# Altium project PROC114E3_SCH.PrjPcb (part 21 of 22)

## Sheet 42.SchDoc
size 513 x 386 mm
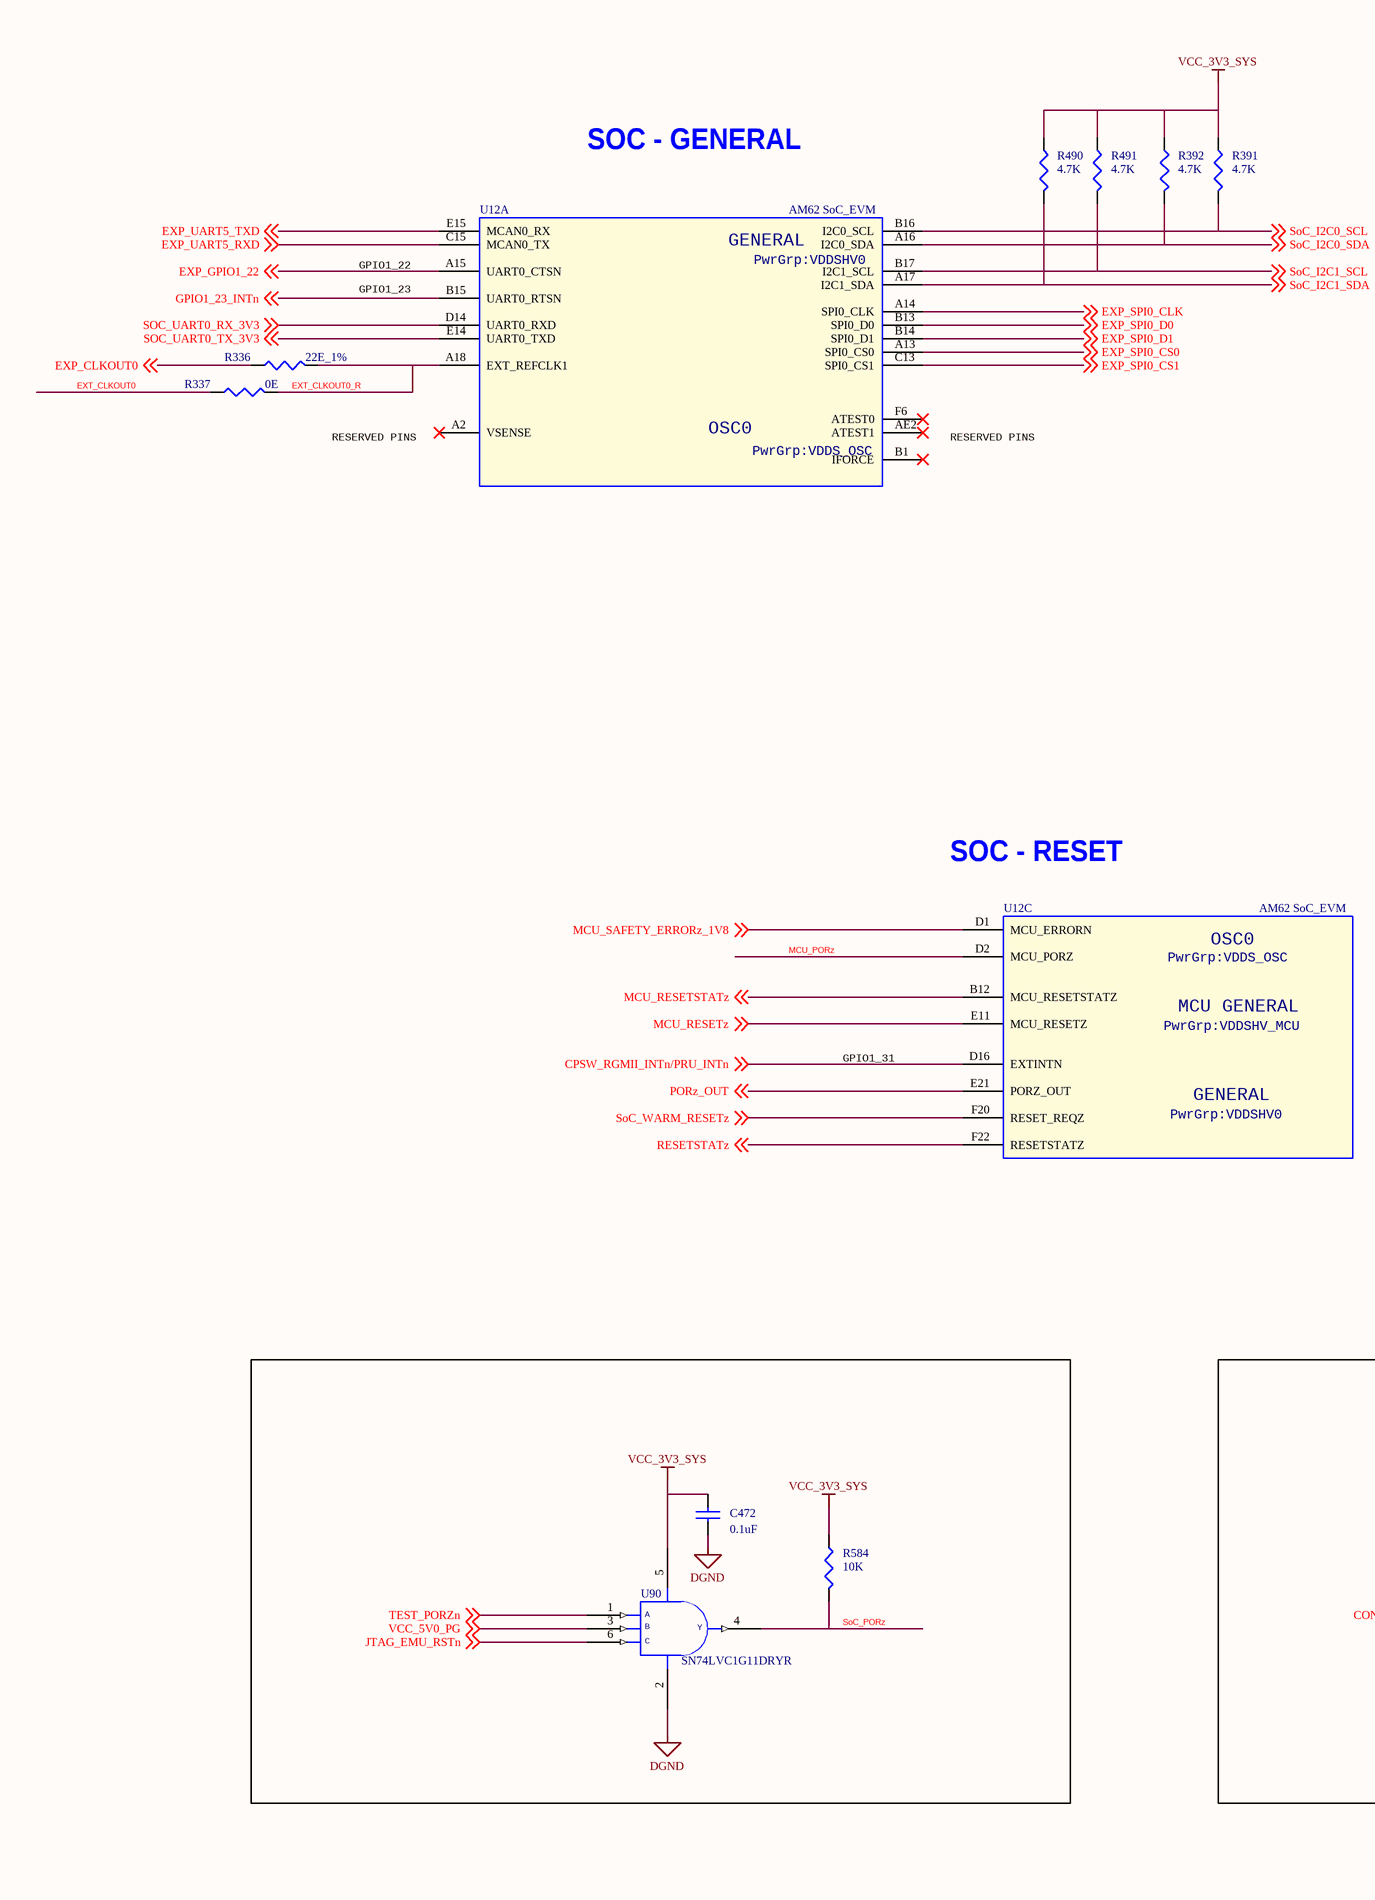
[diagram p75: 42.SchDoc, left]
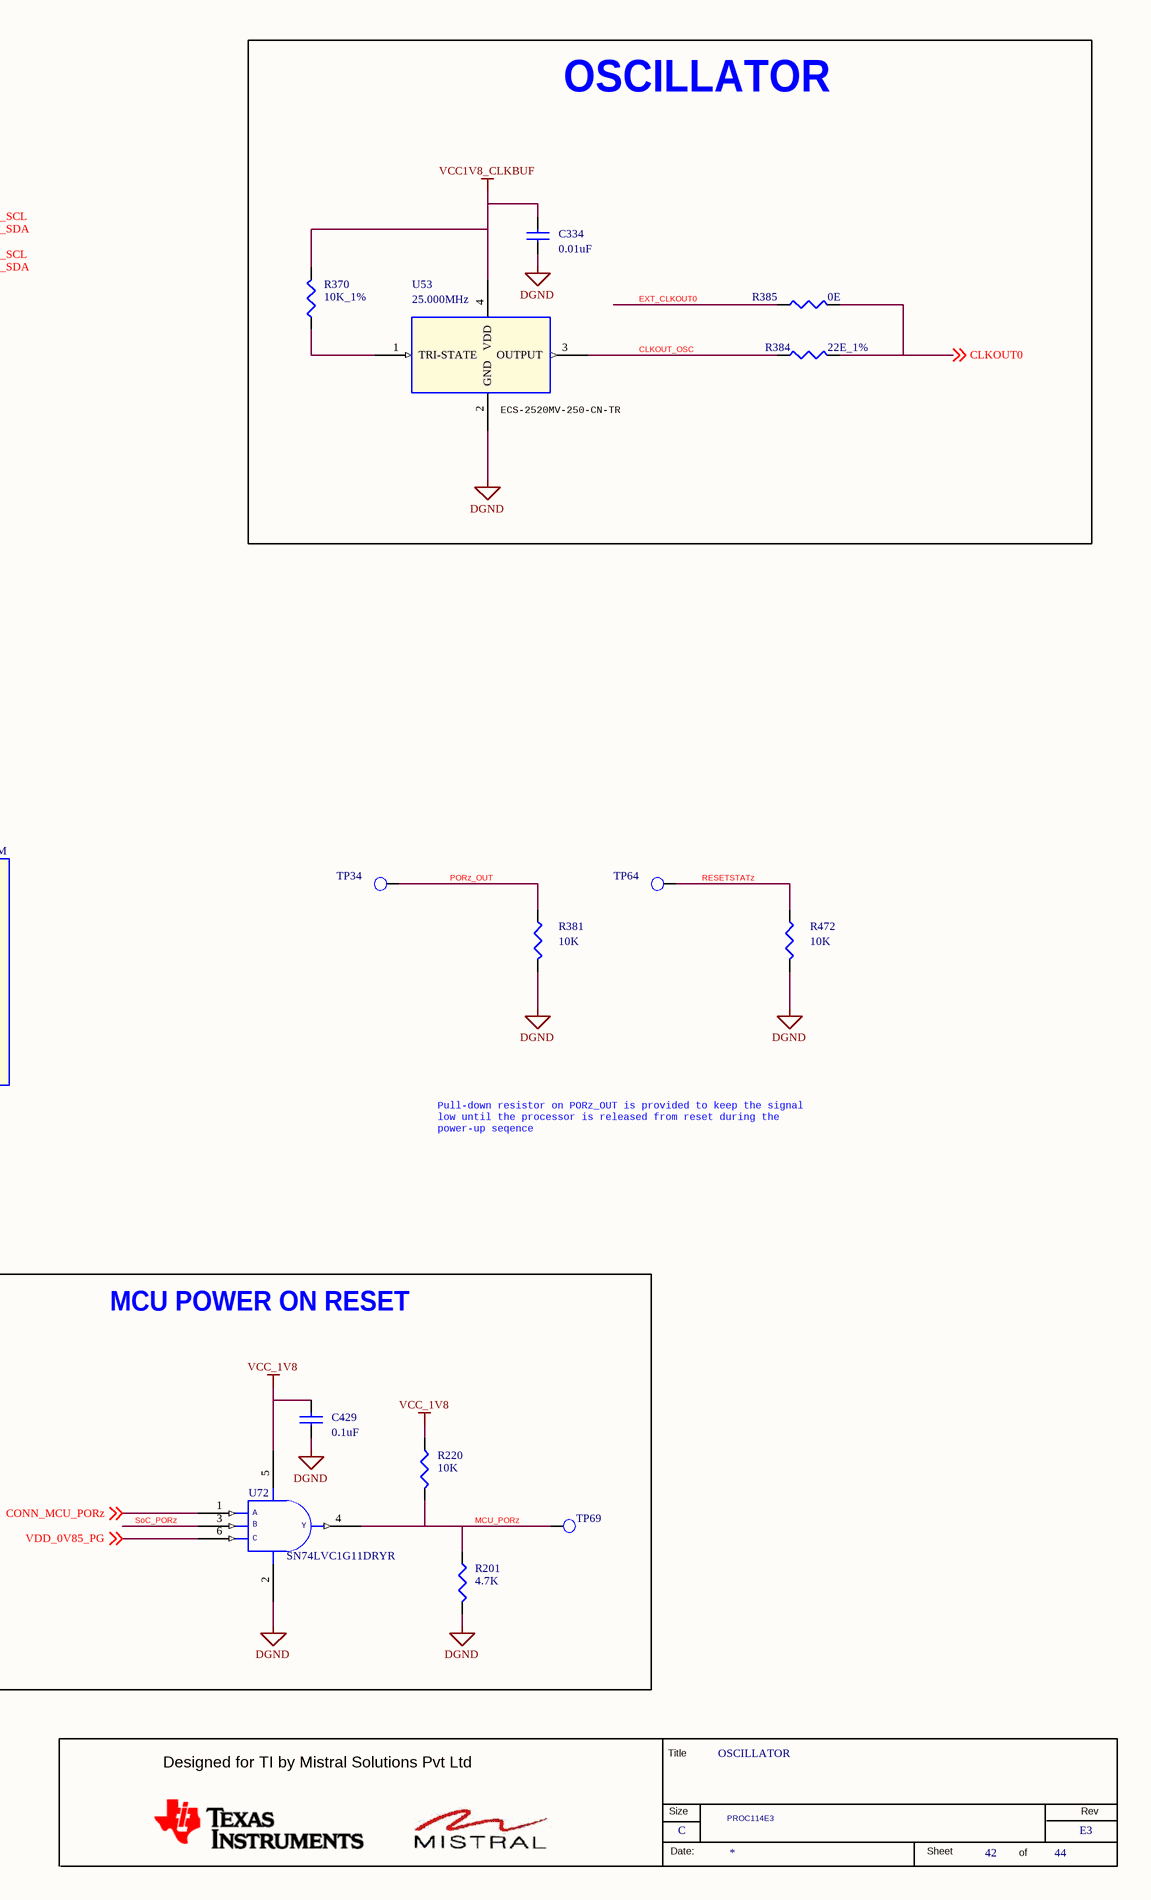
[diagram p76: 42.SchDoc, right]

### Parts
(Parts that share a designator on the sheet are numbered #1, #2 ... from top to bottom, then left to right.)
*#42  RevCode: E3  Title: OSCILLATOR  Page Size: C  Page Number: 42  Page Count: 44  Variant Name: PROC114E3  (hidden comment: MISTRAL_TITLEBLK_CSIZE)  (graphical)
C334  0.01uF  [CAP0201_0-5]
C429  0.1uF  [CAP0201_0-5]
C472  0.1uF  [CAP0201_0-5]
R201  4.7K  [RES0201_0-5]
R220  10K  [RES0201_0-5]
R336  22E_1%  [RES0201_0-5]
R337  0E  [RES0201_0-5]
R370  10K_1%  [RES0201_0-5]
R381  10K  [RES0201_0-5]
R384  22E_1%  [RES0201_0-5]
R385  0E  [RES0201_0-5]
R391  4.7K  [RES0201_0-5]
R392  4.7K  [RES0201_0-5]
R472  10K  [RES0201_0-5]
R490  4.7K  [RES0201_0-5]
R491  4.7K  [RES0201_0-5]
R584  10K  [RES0201_0-5]
TP34  TP20_SMD  [TP20_SMD]  (value not drawn)
TP64  TP20_SMD  [TP20_SMD]  (value not drawn)
TP69  TP20_SMD  [TP20_SMD]  (value not drawn)
U12#2  AM62 SoC_EVM  [BGA425_19-68_510X510_0-7]  (parts A,C of 18)
U53  25.000MHz  [OSC4_ECS-2520MV_100X80_SMD_0-9]
U72  SN74LVC1G11DRYR  [SON6_SN74LVC2G17_40X60_0-6]
U90  SN74LVC1G11DRYR  [SON6_SN74LVC2G17_40X60_0-6]

### Blocks framed on the sheet
OSCILLATOR: C334 R370 R384 R385 U53
MCU POWER ON RESET: C429 R201 R220 TP69 U72

### Nets
DGND: C334.1 C429.1 C472.1 R201.2 R381.2 R472.2 U53.2(GND) U72.2(GND) U90.2(GND)
VCC1V8_CLKBUF: C334.2 R370.2 U53.4(VDD)
VCC_1V8: C429.2 R220.1 U72.5(VCC)
VCC_3V3_SYS: C472.2 R391.1 R392.1 R490.1 R491.1 R584.1 U90.5(VCC)
CLKOUT0: R384.2 R385.2 ; off-sheet CLKOUT0
CLKOUT_OSC: R384.1 U53.3(OUTPUT)
CONN_MCU_PORz: U72.1(A) ; off-sheet CONN_MCU_PORz
CPSW_RGMII_INTn/PRU_INTn: U12#2.D16(EXTINTN) ; off-sheet CPSW_RGMII_INTn/PRU_INTn
EXP_CLKOUT0: R336.1 ; off-sheet EXP_CLKOUT0
EXP_GPIO1_22: U12#2.A15(UART0_CTSN) ; off-sheet EXP_GPIO1_22
EXP_SPI0_CLK: U12#2.A14(SPI0_CLK) ; off-sheet EXP_SPI0_CLK
EXP_SPI0_CS0: U12#2.A13(SPI0_CS0) ; off-sheet EXP_SPI0_CS0
EXP_SPI0_CS1: U12#2.C13(SPI0_CS1) ; off-sheet EXP_SPI0_CS1
EXP_SPI0_D0: U12#2.B13(SPI0_D0) ; off-sheet EXP_SPI0_D0
EXP_SPI0_D1: U12#2.B14(SPI0_D1) ; off-sheet EXP_SPI0_D1
EXP_UART5_RXD: U12#2.C15(MCAN0_TX) ; off-sheet EXP_UART5_RXD
EXP_UART5_TXD: U12#2.E15(MCAN0_RX) ; off-sheet EXP_UART5_TXD
EXT_CLKOUT0: R337.1 R385.1
EXT_CLKOUT0_R: R336.2 R337.2 U12#2.A18(EXT_REFCLK1)
GPIO1_23_INTn: U12#2.B15(UART0_RTSN) ; off-sheet GPIO1_23_INTn
JTAG_EMU_RSTn: U90.6(C) ; off-sheet JTAG_EMU_RSTn
MCU_PORz: R201.1 R220.2 TP69.1(TP) U12#2.D2(MCU_PORZ) U72.4(Y)
MCU_RESETSTATz: U12#2.B12(MCU_RESETSTATZ) ; off-sheet MCU_RESETSTATz
MCU_RESETz: U12#2.E11(MCU_RESETZ) ; off-sheet MCU_RESETz
MCU_SAFETY_ERRORz_1V8: U12#2.D1(MCU_ERRORN) ; off-sheet MCU_SAFETY_ERRORz_1V8
PORz_OUT: R381.1 TP34.1(TP) U12#2.E21(PORZ_OUT) ; off-sheet PORz_OUT
RESETSTATz: R472.1 TP64.1(TP) U12#2.F22(RESETSTATZ) ; off-sheet RESETSTATz
SoC_I2C0_SCL: R391.2 U12#2.B16(I2C0_SCL) ; off-sheet SoC_I2C0_SCL
SoC_I2C0_SDA: R392.2 U12#2.A16(I2C0_SDA) ; off-sheet SoC_I2C0_SDA
SoC_I2C1_SCL: R491.2 U12#2.B17(I2C1_SCL) ; off-sheet SoC_I2C1_SCL
SoC_I2C1_SDA: R490.2 U12#2.A17(I2C1_SDA) ; off-sheet SoC_I2C1_SDA
SoC_PORz: R584.2 U72.3(B) U90.4(Y)
SOC_UART0_RX_3V3: U12#2.D14(UART0_RXD) ; off-sheet SOC_UART0_RX_3V3
SOC_UART0_TX_3V3: U12#2.E14(UART0_TXD) ; off-sheet SOC_UART0_TX_3V3
SoC_WARM_RESETZ: U12#2.F20(RESET_REQZ) ; off-sheet SoC_WARM_RESETz
TEST_PORZn: U90.1(A) ; off-sheet TEST_PORZn
VCC_5V0_PG: U90.3(B) ; off-sheet VCC_5V0_PG
VDD_0V85_PG: U72.6(C) ; off-sheet VDD_0V85_PG
NetR370_1: R370.1 U53.1(TRI-STATE)

Not connected (* = marked no-connect by the designer): U12#2 A2(VSENSE)* AE2(ATEST1)* B1(IFORCE)* F6(ATEST0)*

### Notes on the sheet
- SOC - GENERAL
- GPIO1_22
- GPIO1_23
- RESERVED PINS
- (near U53) ECS-2520MV-250-CN-TR
- SOC - RESET
- GPIO1_31
- Pull-down resistor on PORz_OUT is provided to keep the signal
  low until the processor is released from reset during the
  power-up seqence
- (in symbol AM62-EVM_BGA425, part A) GENERAL; PwrGrp:VDDSHV0; OSC0; PwrGrp:VDDS_OSC
- (in symbol AM62-EVM_BGA425, part C) OSC0; PwrGrp:VDDS_OSC; MCU GENERAL; PwrGrp:VDDSHV_MCU; GENERAL; PwrGrp:VDDSHV0
- (in symbol MISTRAL_TITLEBLK_CSIZE) Title; Designed for TI by Mistral Solutions Pvt Ltd; Size; Rev; Date:; Sheet; of

### Library data of the parts
*#42 = MISTRAL_TITLEBLK_CSIZE: Issue: 1.0; Page Create Date: March  8, 1995; Page Modify Date: *; Schematic Page Count: 44; Schematic Page Number: 42
C334 = CAP_Dup2: CAP CERAMIC 0.01uF 25V 10% X5R 0201; Mistral Part No: 120018010007-R; Mfr_name: MURATA; Mfr_part_number: GRM033R61E103KA12J; Part_type: CAPACITORS\CERAMIC; Wattage: NA; Project: TI_MAXIE_CPB; Customs_HS_Code: 85322990; Custom_Duty: 15%; Footprint Path: Y:\MIS_DATABASE\Library\ALTIUM_TOOL\PCB_FOOTPRINTS\Altium_Footprint_Lib.PcbLib; Library Path: Y:\MIS_DATABASE\Library\ALTIUM_TOOL\SCHEMATICS_PARTS\MS_DISCRETE_Library.schlib; Footprint Ref: CAP0201_0-5; MECHANICAL 3D STEP FILE: CAP0201_0-5; Temperature: -55°C+85°C; Weight: 0.33mg; Tolerance: 10%; Voltage: 25V; Package: 0201; Distributor_name: DIGIKEY; Distributor_part_number: GRM033R61E103KA12J-ND; Height: 0.33MM; Datasheet: Y:\MIS_DATABASE\DATASHEETS\CAPACITORS\GRM033R61E103KA12.PDF; Crtd /date: MANIRAJA/230118; Chkd/date: MANIRAJA/230118; Library Ref: CAP; PCB Footprint: CAP0201_0-5
C429 = CAP_Dup2: as C8 on sheet 37; PCB Footprint: CAP0201_0-5; Footprint Path: Y:\MIS_DATABASE\Library\ALTIUM_TOOL\PCB_FOOTPRINTS\Altium_Footprint_Lib.PcbLib; Library Path: Y:\MIS_DATABASE\Library\ALTIUM_TOOL\SCHEMATICS_PARTS\MS_DISCRETE_Library.schlib; Footprint Ref: CAP0201_0-5; Library Ref: CAP; MECHANICAL 3D STEP FILE: CAP0201_0-5; Chkd/date: MANIRAJA/230118; Crtd /date: MANIRAJA/230118; Datasheet: Y:\MIS_DATABASE\DATASHEETS\CAPACITORS\GRM033R61C104KE14.PDF; Temperature: -55°C+85°C; Weight: 0.33mg; Height: 0.33MM; Distributor_part_number: 490-14305-1-ND; Distributor_name: DIGIKEY; Package: 0201; Voltage: 16V; Tolerance: 10%
C472 = CAP_Dup2: as C497 on sheet 37; PCB Footprint: CAP0201_0-5; Tolerance: 10%; Voltage: 16V; Package: 0201; Distributor_name: DIGIKEY; Distributor_part_number: 490-14305-1-ND; Height: 0.33MM; Weight: 0.33mg; Temperature: -55°C+85°C; Datasheet: Y:\MIS_DATABASE\DATASHEETS\CAPACITORS\GRM033R61C104KE14.PDF; Crtd /date: MANIRAJA/230118; Chkd/date: MANIRAJA/230118; MECHANICAL 3D STEP FILE: CAP0201_0-5; Library Ref: CAP; Footprint Ref: CAP0201_0-5; Library Path: Y:\MIS_DATABASE\Library\ALTIUM_TOOL\SCHEMATICS_PARTS\MS_DISCRETE_Library.schlib; Footprint Path: Y:\MIS_DATABASE\Library\ALTIUM_TOOL\PCB_FOOTPRINTS\Altium_Footprint_Lib.PcbLib
R201 R391 = RESISTOR_Dup6: as R165 on sheet 37; PCB Footprint: RES0201_0-5; Footprint Ref: RES0201_0-5; Tolerance: 5%; Wattage: 1/20W; Package: 0201; Distributor_name: DIGIKEY; Distributor_part_number: 311-4.7KNCT-ND; Library Ref: RESISTOR; Height: 0.26MM; Weight: 0.17mg; Temperature: -55°C+125°C; Datasheet: Y:\MIS_DATABASE\DATASHEETS\RESISTORS\RCXXXXL-SER_MAR18.PDF; Crtd /date: ALVY/200921; Chkd/date: MANIRAJA/200921; MECHANICAL 3D STEP FILE: RES0201_0-5; Library Path: Y:\MIS_DATABASE\Library\ALTIUM_TOOL\SCHEMATICS_PARTS\MS_DISCRETE_Library.schlib; Footprint Path: Y:\MIS_DATABASE\Library\ALTIUM_TOOL\PCB_FOOTPRINTS\Altium_Footprint_Lib.PcbLib
R220 R381 = RESISTOR_Dup6: as R16 on sheet 37; MECHANICAL 3D STEP FILE: RES0201_0-5; Chkd/date: MANIRAJA/050517; Crtd /date: MANIRAJA/050517; Datasheet: Y:\MIS_DATABASE\DATASHEETS\RESISTORS\RCXXXXL-SER_MAR18.PDF; Temperature: -55°C+125°C; Weight: 0.17mg; Height: 0.26MM; Distributor_part_number: 311-10KNCT-ND; Distributor_name: DIGIKEY; Package: 0201; Wattage: 1/20W; Tolerance: 5%; Library Ref: RESISTOR; Footprint Ref: RES0201_0-5; Library Path: Y:\MIS_DATABASE\Library\ALTIUM_TOOL\SCHEMATICS_PARTS\MS_DISCRETE_Library.schlib; Footprint Path: Y:\MIS_DATABASE\Library\ALTIUM_TOOL\PCB_FOOTPRINTS\Altium_Footprint_Lib.PcbLib; PCB Footprint: RES0201_0-5
R336 R384 = RESISTOR_Dup1: RES 22E 1/20W 1% 0201; Mistral Part No: 110009030522-R; Mfr_name: YAGEO AMERICA; Mfr_part_number: RC0201FR-0722RL; Part_type: RESISTORS\FIXED; Project: AM654x_SOM; Voltage: NA; Customs_HS_Code: 85332119; Custom_Duty: 15%; Footprint Ref: RES0201_0-5; Tolerance: 1%; Wattage: 1/20W; Package: 0201; Distributor_name: DIGIKEY; Distributor_part_number: YAG2518CT-ND; Library Ref: RESISTOR; Height: 0.26MM; Weight: 0.17mg; Temperature: -55°C+125°C; Datasheet: Y:\MIS_DATABASE\DATASHEETS\RESISTORS\RCXXXXL-SER_MAR18.PDF; Crtd /date: ALVY/080319; Chkd/date: MANIRAJA/080319; MECHANICAL 3D STEP FILE: RES0201_0-5; Library Path: Y:\MIS_DATABASE\Library\ALTIUM_TOOL\SCHEMATICS_PARTS\MS_DISCRETE_Library.schlib; Footprint Path: Y:\MIS_DATABASE\Library\ALTIUM_TOOL\PCB_FOOTPRINTS\Altium_Footprint_Lib.PcbLib; PCB Footprint: RES0201_0-5
R337 R385 = RESISTOR_Dup4: RES 0E 1/20W 5% 0201; Mistral Part No: 110010070067-R; Mfr_name: YAGEO AMERICA; Mfr_part_number: RC0201JR-070RL; Part_type: RESISTORS\FIXED; Project: PB_BUGBASE; Voltage: NA; Customs_HS_Code: 85332119; Custom_Duty: 15%; PCB Footprint: RES0201_0-5; MECHANICAL 3D STEP FILE: RES0201_0-5; Tolerance: 5%; Wattage: 1/20W; Package: 0201; Distributor_name: DIGIKEY; Distributor_part_number: 311-0.0NCT-ND; Height: 0.26MM; Weight: 0.17mg; Temperature: -55°C+125°C; Datasheet: Y:\MIS_DATABASE\DATASHEETS\RESISTORS\RCXXXXL-SER_MAR18.PDF; Crtd /date: MUDDU/120710; Chkd/date: NAVEED/301214; Library Ref: RESISTOR; Footprint Ref: RES0201_0-5; Library Path: Y:\MIS_DATABASE\Library\ALTIUM_TOOL\SCHEMATICS_PARTS\MS_DISCRETE_Library.schlib; Footprint Path: Y:\MIS_DATABASE\Library\ALTIUM_TOOL\PCB_FOOTPRINTS\Altium_Footprint_Lib.PcbLib
R370 = RESISTOR_Dup4: RES 10K 1/20W 1% 0201; Part_type: RESISTORS\FIXED; Mfr_part_number: RC0201FR-0710KL; Mfr_name: YAGEO AMERICA; Mistral Part No: 110011040018-R; Custom_Duty: 15%; Customs_HS_Code: 85332119; Voltage: NA; Project: GOLDEN-I LITE; Footprint Path: Y:\MIS_DATABASE\Library\ALTIUM_TOOL\PCB_FOOTPRINTS\Altium_Footprint_Lib.PcbLib; Library Path: Y:\MIS_DATABASE\Library\ALTIUM_TOOL\SCHEMATICS_PARTS\MS_DISCRETE_Library.schlib; Footprint Ref: RES0201_0-5; Library Ref: RESISTOR; Chkd/date: VASANTHA/270117; Crtd /date: MANIRAJA/270117; Datasheet: Y:\MIS_DATABASE\DATASHEETS\RESISTORS\RCXXXXL-SER_MAR18.PDF; Temperature: -55°C+125°C; Weight: 0.17mg; Height: 0.26MM; Distributor_part_number: 311-10.0KMCT-ND; Distributor_name: DIGIKEY; Package: 0201; Wattage: 1/20W; Tolerance: 1%; MECHANICAL 3D STEP FILE: RES0201_0-5; PCB Footprint: RES0201_0-5
R392 R490 R491 = RESISTOR_Dup6: as R61 on sheet 41; Footprint Path: Y:\MIS_DATABASE\Library\ALTIUM_TOOL\PCB_FOOTPRINTS\Altium_Footprint_Lib.PcbLib; Library Path: Y:\MIS_DATABASE\Library\ALTIUM_TOOL\SCHEMATICS_PARTS\MS_DISCRETE_Library.schlib; MECHANICAL 3D STEP FILE: RES0201_0-5; Chkd/date: MANIRAJA/200921; Crtd /date: ALVY/200921; Datasheet: Y:\MIS_DATABASE\DATASHEETS\RESISTORS\RCXXXXL-SER_MAR18.PDF; Temperature: -55°C+125°C; Weight: 0.17mg; Height: 0.26MM; Library Ref: RESISTOR; Distributor_part_number: 311-4.7KNCT-ND; Distributor_name: DIGIKEY; Package: 0201; Wattage: 1/20W; Tolerance: 5%; Footprint Ref: RES0201_0-5; PCB Footprint: RES0201_0-5
R472 R584 = RESISTOR_Dup6: as R176 on sheet 37; Footprint Path: Y:\MIS_DATABASE\Library\ALTIUM_TOOL\PCB_FOOTPRINTS\Altium_Footprint_Lib.PcbLib; Library Path: Y:\MIS_DATABASE\Library\ALTIUM_TOOL\SCHEMATICS_PARTS\MS_DISCRETE_Library.schlib; Footprint Ref: RES0201_0-5; Library Ref: RESISTOR; Tolerance: 5%; Wattage: 1/20W; Package: 0201; Distributor_name: DIGIKEY; Distributor_part_number: 311-10KNCT-ND; Height: 0.26MM; Weight: 0.17mg; Temperature: -55°C+125°C; Datasheet: Y:\MIS_DATABASE\DATASHEETS\RESISTORS\RCXXXXL-SER_MAR18.PDF; Crtd /date: MANIRAJA/050517; Chkd/date: MANIRAJA/050517; MECHANICAL 3D STEP FILE: RES0201_0-5; PCB Footprint: RES0201_0-5
TP34 TP69 = TESTPOINT: as TP50 on sheet 40; PCB Footprint: TP20_SMD; Customs_HS_Code: NA; RoHS: NA; Footprint Ref: TP20_SMD; Library Ref: TESTPOINT; Footprint Path: Y:\MIS_DATABASE\Library\ALTIUM_TOOL\PCB_FOOTPRINTS\Altium_Footprint_Lib.PcbLib; Library Path: Y:\MIS_DATABASE\Library\ALTIUM_TOOL\SCHEMATICS_PARTS\MS_DISCRETE_Library.schlib; MECHANICAL 3D STEP FILE: NA; Datasheet: NA; Temperature: NA; Weight: NA; Wattage: NA; Voltage: NA; Tolerance: NA; Chkd/date: SHREESHAIL/171006; Crtd /date: MAZHAR/171006; Height: NA; Distributor_part_number: NA; Distributor_name: NA; Package: SMD; Part_type: TESTPOINT; Mfr_part_number: TP20_SMD; Mistral Part No: NA
TP64 = TESTPOINT: as TP49 on sheet 40; PCB Footprint: TP20_SMD; Mfr_part_number: TP20_SMD; Part_type: TESTPOINT; Package: SMD; Distributor_name: NA; Distributor_part_number: NA; Height: NA; Crtd /date: MAZHAR/171006; Chkd/date: SHREESHAIL/171006; Tolerance: NA; Voltage: NA; Wattage: NA; Weight: NA; Temperature: NA; Datasheet: NA; MECHANICAL 3D STEP FILE: NA; Library Path: Y:\MIS_DATABASE\Library\ALTIUM_TOOL\SCHEMATICS_PARTS\MS_DISCRETE_Library.schlib; Footprint Path: Y:\MIS_DATABASE\Library\ALTIUM_TOOL\PCB_FOOTPRINTS\Altium_Footprint_Lib.PcbLib; Library Ref: TESTPOINT; Footprint Ref: TP20_SMD; RoHS: NA; Customs_HS_Code: NA; Custom_Duty: NA
U12#2 = AM62-EVM_BGA425: IC AM62 SoC MICROPROCESSOR BGA425; Part_type: ICS\DIGITAL\MICROPROCESSOR; Mfr_name: TEXAS INSTRUMENTS; Mistral Part No: 141221060001; Custom_Duty: 15%; Customs_HS_Code: 85423100; Wattage: NA; Project: AM62_EVM_BRD; Footprint Path: Y:\MIS_DATABASE\Library\ALTIUM_TOOL\PCB_FOOTPRINTS\Altium_Footprint_Lib.PcbLib; Library Path: Y:\MIS_DATABASE\Library\ALTIUM_TOOL\SCHEMATICS_PARTS\MS_MICROPROCESSOR_Library.schlib; MECHANICAL 3D STEP FILE: BGA425_19-68_510X510_0-7; RoHS: NA; Chkd/date: ALVY/110621; Crtd /date: MANIRAJA/110621; Datasheet: Y:\MIS_DATABASE\DATASHEETS\ICS\DIGITAL\MICROCONTROLLER\AM62-SoC_SVB.PDF; Temperature: NA; Weight: NA; Height: 0.65MM; Footprint Ref: BGA425_19-68_510X510_0-7; Library Ref: AM62-EVM_BGA425; Distributor_part_number: NA; Distributor_name: NA; Package: BGA425; Voltage: NA; Tolerance: NA; Mfr_part_number: AM62 SoC_EVM; PCB Footprint: BGA425_19-68_510X510_0-7
U53 = OSC4_ASFL3: OSC 25.000MHz CMOS SMD; Mistral Part No: 130020110041-R; Mfr_name: ECS INC; Mfr_part_number: ECS-2520MV-250-CN-TR; Part_type: OSCILLATORS; Project: AM64X_SKEVM; Tolerance: NA; Customs_HS_Code: 85437099; Custom_Duty: 24%; Voltage: NA; Wattage: NA; Package: SMD; Distributor_name: DIGIKEY; Distributor_part_number: XC2752CT-ND; Library Ref: OSC4_ASFL3; Footprint Ref: OSC4_ECS-2520MV_100X80_SMD_0-9; Height: 0.90MM; Weight: 311mg; Temperature: -40°C+85°C; Datasheet: Y:\MIS_DATABASE\DATASHEETS\MISC\CRY_OSC\ECS-2520MV.PDF; Crtd /date: ALVY/181120; Chkd/date: MANIRAJA/181120; MECHANICAL 3D STEP FILE: OSC4_ECS-2520MV_100X80_SMD_0-9; Library Path: Y:\MIS_DATABASE\Library\ALTIUM_TOOL\SCHEMATICS_PARTS\MS_DISCRETE_Library.schlib; Footprint Path: Y:\MIS_DATABASE\Library\ALTIUM_TOOL\PCB_FOOTPRINTS\Altium_Footprint_Lib.PcbLib; PCB Footprint: OSC4_ECS-2520MV_100X80_SMD_0-9
U72 = SN74LVC1G11DCKR_SC70-6: IC SINGLE 3-INPUT POSITIVE-AND GATE SON6; Mistral Part No: 141021010013-R; Mfr_name: TEXAS INSTRUMENTS; Part_type: ICS\DIGITAL\GATES; Project: AM64X_SKEVM; Tolerance: NA; Customs_HS_Code: 85423100; Custom_Duty: 15%; PCB Footprint: SON6_SN74LVC2G17_40X60_0-6; Footprint Ref: SON6_SN74LVC2G17_40X60_0-6; Mfr_part_number: SN74LVC1G11DRYR; Voltage: NA; Wattage: NA; Package: SON6; Distributor_name: DIGIKEY; Distributor_part_number: 296-30120-1-ND; Library Ref: SN74LVC1G11DCKR_SC70-6; Height: 0.60MM; Weight: 33mg; Temperature: -40°C+125°C; Datasheet: Y:\MIS_DATABASE\DATASHEETS\ICS\DIGITAL\GATES\SN74LVC1G_NOV16.PDF; Crtd /date: ALVY/270121; Chkd/date: MANIRAJA/270121; MECHANICAL 3D STEP FILE: SON6_SN74LVC2G17_40X60_0-6; Library Path: Y:\MIS_DATABASE\Library\ALTIUM_TOOL\SCHEMATICS_PARTS\MS_GATE_Library.schlib; Footprint Path: Y:\MIS_DATABASE\Library\ALTIUM_TOOL\PCB_FOOTPRINTS\Altium_Footprint_Lib.PcbLib
U90 = SN74LVC1G11DCKR_SC70-6: IC SINGLE 3-INPUT POSITIVE-AND GATE SON6; Part_type: ICS\DIGITAL\GATES; Mfr_name: TEXAS INSTRUMENTS; Mistral Part No: 141021010013-R; Custom_Duty: 15%; Customs_HS_Code: 85423100; Wattage: NA; Project: AM64X_SKEVM; Footprint Path: Y:\MIS_DATABASE\Library\ALTIUM_TOOL\PCB_FOOTPRINTS\Altium_Footprint_Lib.PcbLib; Library Path: Y:\MIS_DATABASE\Library\ALTIUM_TOOL\SCHEMATICS_PARTS\MS_GATE_Library.schlib; MECHANICAL 3D STEP FILE: SON6_SN74LVC2G17_40X60_0-6; Chkd/date: MANIRAJA/270121; Crtd /date: ALVY/270121; Datasheet: Y:\MIS_DATABASE\DATASHEETS\ICS\DIGITAL\GATES\SN74LVC1G_NOV16.PDF; Temperature: -40°C+125°C; Weight: 33mg; Height: 0.60MM; Library Ref: SN74LVC1G11DCKR_SC70-6; Distributor_part_number: 296-30120-1-ND; Distributor_name: DIGIKEY; Package: SON6; Voltage: NA; Tolerance: NA; Mfr_part_number: SN74LVC1G11DRYR; Footprint Ref: SON6_SN74LVC2G17_40X60_0-6; PCB Footprint: SON6_SN74LVC2G17_40X60_0-6

## Sheet 43.SchDoc
size 513 x 386 mm
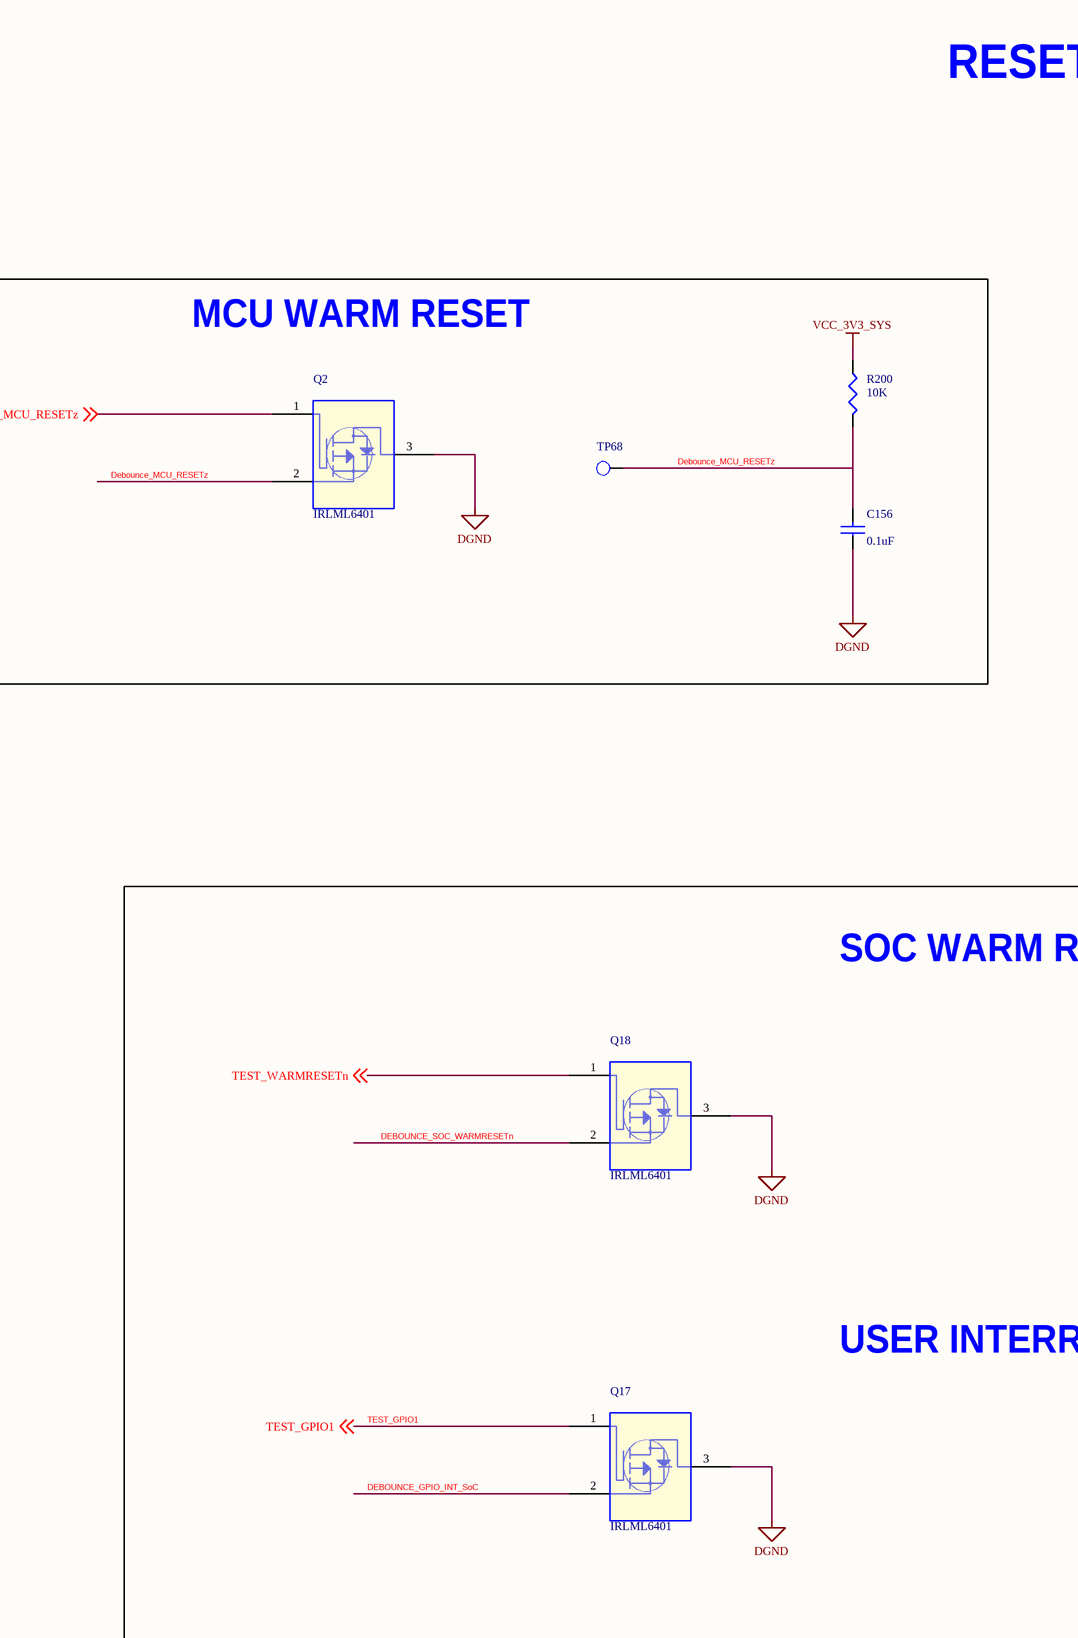
[diagram p77: 43.SchDoc, left]
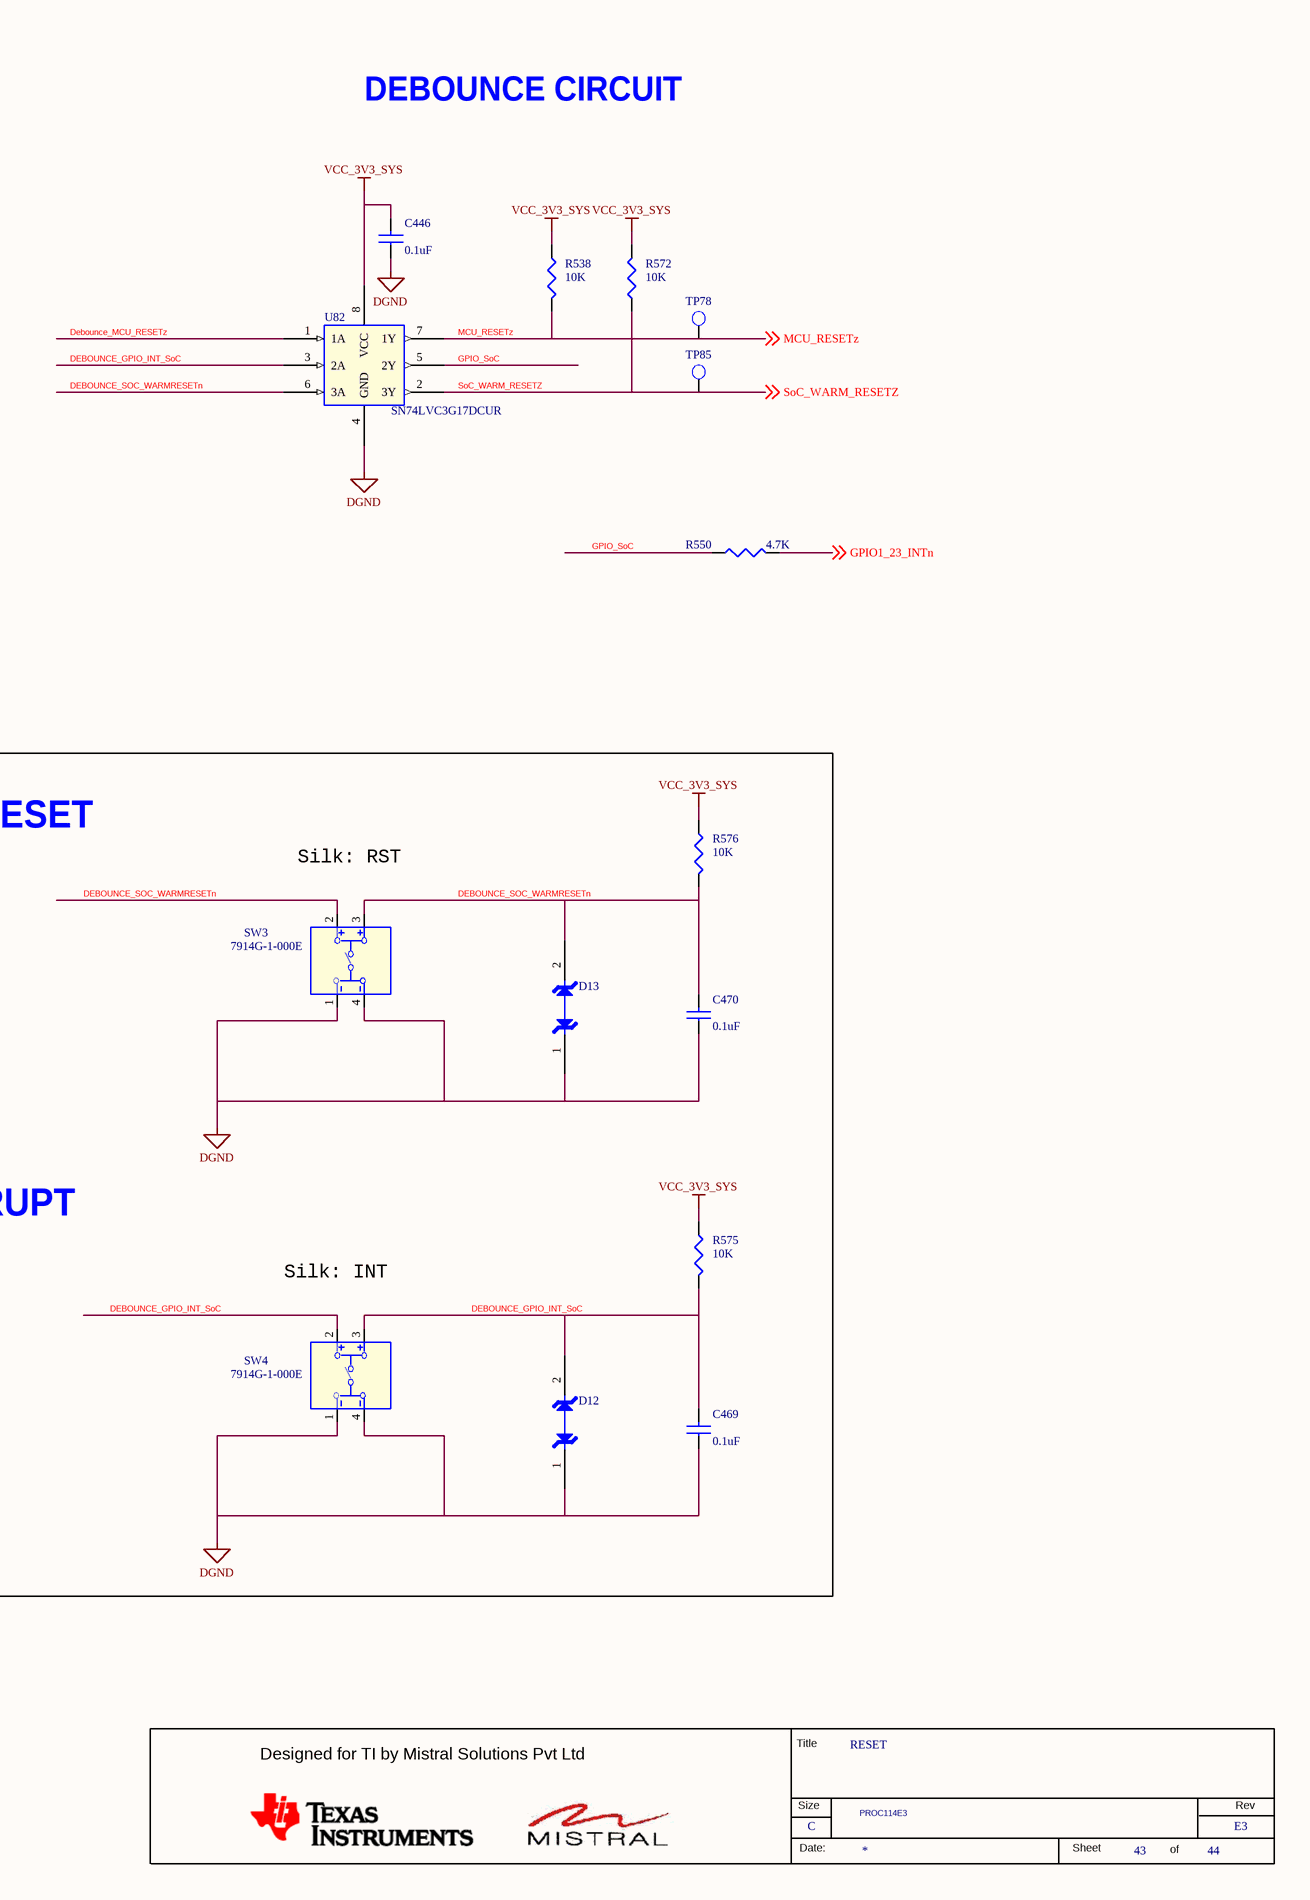
[diagram p78: 43.SchDoc, right]

### Parts
(Parts that share a designator on the sheet are numbered #1, #2 ... from top to bottom, then left to right.)
*#43  RevCode: E3  Title: RESET  Page Size: C  Page Number: 43  Page Count: 44  Variant Name: PROC114E3  (hidden comment: MISTRAL_TITLEBLK_CSIZE)  (graphical)
C156  0.1uF  [CAP0201_0-5]
C446  0.1uF  [CAP0201_0-5]
C469  0.1uF  [CAP0201_0-5]
C470  0.1uF  [CAP0201_0-5]
D12  TPD1E10B06DPYR  [DIO_DFN0402_0-5]  (value not drawn)
D13  TPD1E10B06DPYR  [DIO_DFN0402_0-5]  (value not drawn)
Q2  IRLML6401  [TO_SOT23-123]
Q17  IRLML6401  [TO_SOT23-123]
Q18  IRLML6401  [TO_SOT23-123]
R200  10K  [RES0201_0-5]
R538  10K  [RES0201_0-5]
R550  4.7K  [RES0201_0-5]
R572  10K  [RES0201_0-5]
R575  10K  [RES0201_0-5]
R576  10K  [RES0201_0-5]
SW3  7914G-1-000E  [SW4_100X216_200X200_SMD_4-2]
SW4  7914G-1-000E  [SW4_100X216_200X200_SMD_4-2]
TP68  TP20_SMD  [TP20_SMD]  (value not drawn)
TP78  TP20_SMD  [TP20_SMD]  (value not drawn)
TP85  TP20_SMD  [TP20_SMD]  (value not drawn)
U82  SN74LVC3G17DCUR  [VSSOP8_19-68_85X95_0-9]

### Blocks framed on the sheet
MCU WARM RESET: C156 Q2 R200 TP68

### Nets
DGND: C156.1 C446.1 C469.1 C470.1 D12.1 D13.1 Q2.3(D) Q17.3(D) Q18.3(D) SW3.1 SW3.4 SW4.1 SW4.4 U82.4(GND)
VCC_3V3_SYS: C446.2 R200.1 R538.1 R572.2 R575.1 R576.1 U82.8(VCC)
CONN_MCU_RESETz: Q2.1(G) ; off-sheet CONN_MCU_RESETz
DEBOUNCE_GPIO_INT_SoC: C469.2 D12.2 Q17.2(S) R575.2 SW4.2 SW4.3 U82.3(2A)
Debounce_MCU_RESETz: C156.2 Q2.2(S) R200.2 TP68.1(TP) U82.1(1A)
DEBOUNCE_SOC_WARMRESETn: C470.2 D13.2 Q18.2(S) R576.2 SW3.2 SW3.3 U82.6(3A)
GPIO1_23_INTn: R550.2 ; off-sheet GPIO1_23_INTn
GPIO_SoC: R550.1 U82.5(2Y)
MCU_RESETz: R538.2 TP78.1(TP) U82.7(1Y) ; off-sheet MCU_RESETz
SoC_WARM_RESETZ: R572.1 TP85.1(TP) U82.2(3Y) ; off-sheet SoC_WARM_RESETZ
TEST_GPIO1: Q17.1(G) ; off-sheet TEST_GPIO1
TEST_WARMRESETn: Q18.1(G) ; off-sheet TEST_WARMRESETn

### Notes on the sheet
- RESET
- DEBOUNCE CIRCUIT
- SOC WARM RESET
- Silk: RST
- USER INTERRUPT
- Silk: INT
- (in symbol MISTRAL_TITLEBLK_CSIZE) Title; Designed for TI by Mistral Solutions Pvt Ltd; Size; Rev; Date:; Sheet; of

### Library data of the parts
*#43 = MISTRAL_TITLEBLK_CSIZE: Issue: 1.0; Page Create Date: March  8, 1995; Page Modify Date: *; Schematic Page Count: 44; Schematic Page Number: 43
C156 C470 = CAP_Dup2: as C497 on sheet 37; Tolerance: 10%; Voltage: 16V; Package: 0201; Distributor_name: DIGIKEY; Distributor_part_number: 490-14305-1-ND; Height: 0.33MM; Weight: 0.33mg; Temperature: -55°C+85°C; Datasheet: Y:\MIS_DATABASE\DATASHEETS\CAPACITORS\GRM033R61C104KE14.PDF; Crtd /date: MANIRAJA/230118; Chkd/date: MANIRAJA/230118; MECHANICAL 3D STEP FILE: CAP0201_0-5; Library Ref: CAP; Footprint Ref: CAP0201_0-5; Library Path: Y:\MIS_DATABASE\Library\ALTIUM_TOOL\SCHEMATICS_PARTS\MS_DISCRETE_Library.schlib; Footprint Path: Y:\MIS_DATABASE\Library\ALTIUM_TOOL\PCB_FOOTPRINTS\Altium_Footprint_Lib.PcbLib; PCB Footprint: CAP0201_0-5
C446 C469 = CAP_Dup2: as C8 on sheet 37; Footprint Path: Y:\MIS_DATABASE\Library\ALTIUM_TOOL\PCB_FOOTPRINTS\Altium_Footprint_Lib.PcbLib; Library Path: Y:\MIS_DATABASE\Library\ALTIUM_TOOL\SCHEMATICS_PARTS\MS_DISCRETE_Library.schlib; Footprint Ref: CAP0201_0-5; Library Ref: CAP; MECHANICAL 3D STEP FILE: CAP0201_0-5; Chkd/date: MANIRAJA/230118; Crtd /date: MANIRAJA/230118; Datasheet: Y:\MIS_DATABASE\DATASHEETS\CAPACITORS\GRM033R61C104KE14.PDF; Temperature: -55°C+85°C; Weight: 0.33mg; Height: 0.33MM; Distributor_part_number: 490-14305-1-ND; Distributor_name: DIGIKEY; Package: 0201; Voltage: 16V; Tolerance: 10%; PCB Footprint: CAP0201_0-5
D12 D13 = DIODE_SOD323: DIODE 1CH ESD PROTECTION X1SON2; Mistral Part No: 130014110022-R; Mfr_name: TEXAS INSTRUMENTS; Project: GALILEO_EVM; Tolerance: NA; Customs_HS_Code: 85423100; Custom_Duty: 15%; PCB Footprint: DIO_DFN0402_0-5; Footprint Ref: DIO_DFN0402_0-5; Mfr_part_number: TPD1E10B06DPYR; Part_type: DIODE; Voltage: NA; Wattage: NA; Package: X1SON2; Distributor_name: DIGIKEY; Distributor_part_number: 296-30406-1-ND; Library Ref: DIODE_SOD323; Height: 0.45MM; Weight: 1mg; Temperature: -40°C+125°C; Datasheet: Y:\MIS_DATABASE\DATASHEETS\ICS\INTERFACE\TPD1E10B06-SER.PDF; Crtd /date: VASANTHA/181114; Chkd/date: MANIRAJA/040420; MECHANICAL 3D STEP FILE: DIO_DFN0402_0-5; Library Path: Y:\MIS_DATABASE\Library\ALTIUM_TOOL\SCHEMATICS_PARTS\MS_DISCRETE_Library.schlib; Footprint Path: Y:\MIS_DATABASE\Library\ALTIUM_TOOL\PCB_FOOTPRINTS\Altium_Footprint_Lib.PcbLib
Q2 Q18 = MOSFET_IRLML6401TR: TRANSISTOR MOSFET P-CHANNEL SOT23-3; Mistral Part No: 130009031213-P; Mfr_name: IRF; Mfr_part_number: IRLML6401TRPBF; Part_type: TRANSISTOR\MOSFET; Project: G4_SVGA; Tolerance: NA; Customs_HS_Code: 85412900; Custom_Duty: 15%; Voltage: NA; Wattage: NA; Package: SOT23-3; Distributor_name: DIGIKEY; Distributor_part_number: IRLML6401PBFCT-ND; Height: 1.11MM; Weight: NA; Temperature: -55°C+150°C; Datasheet: Y:\MIS_DATABASE\DATASHEETS\DISCRETES\TRANSISTORS_FETS\IRLML6401.PDF; Crtd /date: MAZHAR/040505; Chkd/date: SHREESHAIL/020206; RoHS: Pb-Free; Library Ref: MOSFET_IRLML6401TR; PCB Footprint: TO_SOT23-123
Q17 = MOSFET_IRLML6401TR: TRANSISTOR MOSFET P-CHANNEL SOT23-3; Part_type: TRANSISTOR\MOSFET; Mfr_part_number: IRLML6401TRPBF; Mfr_name: IRF; Mistral Part No: 130009031213-P; Custom_Duty: 15%; Customs_HS_Code: 85412900; Wattage: NA; Project: G4_SVGA; Library Ref: MOSFET_IRLML6401TR; RoHS: Pb-Free; Chkd/date: SHREESHAIL/020206; Crtd /date: MAZHAR/040505; Datasheet: Y:\MIS_DATABASE\DATASHEETS\DISCRETES\TRANSISTORS_FETS\IRLML6401.PDF; Temperature: -55°C+150°C; Weight: NA; Height: 1.11MM; Distributor_part_number: IRLML6401PBFCT-ND; Distributor_name: DIGIKEY; Package: SOT23-3; Voltage: NA; Tolerance: NA; PCB Footprint: TO_SOT23-123
R200 R538 R575 = RESISTOR_Dup6: as R16 on sheet 37; Footprint Path: Y:\MIS_DATABASE\Library\ALTIUM_TOOL\PCB_FOOTPRINTS\Altium_Footprint_Lib.PcbLib; Library Path: Y:\MIS_DATABASE\Library\ALTIUM_TOOL\SCHEMATICS_PARTS\MS_DISCRETE_Library.schlib; MECHANICAL 3D STEP FILE: RES0201_0-5; Chkd/date: MANIRAJA/050517; Crtd /date: MANIRAJA/050517; Datasheet: Y:\MIS_DATABASE\DATASHEETS\RESISTORS\RCXXXXL-SER_MAR18.PDF; Temperature: -55°C+125°C; Weight: 0.17mg; Height: 0.26MM; Library Ref: RESISTOR; Distributor_part_number: 311-10KNCT-ND; Distributor_name: DIGIKEY; Package: 0201; Wattage: 1/20W; Tolerance: 5%; Footprint Ref: RES0201_0-5; PCB Footprint: RES0201_0-5
R550 = RESISTOR_Dup4: RES 4.7K 1/20W 5% 0201; Mistral Part No: 110021090007-R; Mfr_name: YAGEO AMERICA; Mfr_part_number: RC0201JR-074K7L; Part_type: RESISTORS\FIXED; Project: TI_AM62x SKEVM_BRD; Voltage: NA; Customs_HS_Code: 85332119; Custom_Duty: 15%; PCB Footprint: RES0201_0-5; MECHANICAL 3D STEP FILE: RES0201_0-5; Tolerance: 5%; Wattage: 1/20W; Package: 0201; Distributor_name: DIGIKEY; Distributor_part_number: 311-4.7KNCT-ND; Height: 0.26MM; Weight: 0.17mg; Temperature: -55°C+125°C; Datasheet: Y:\MIS_DATABASE\DATASHEETS\RESISTORS\RCXXXXL-SER_MAR18.PDF; Crtd /date: ALVY/200921; Chkd/date: MANIRAJA/200921; Library Ref: RESISTOR; Footprint Ref: RES0201_0-5; Library Path: Y:\MIS_DATABASE\Library\ALTIUM_TOOL\SCHEMATICS_PARTS\MS_DISCRETE_Library.schlib; Footprint Path: Y:\MIS_DATABASE\Library\ALTIUM_TOOL\PCB_FOOTPRINTS\Altium_Footprint_Lib.PcbLib; Manufacturer: YAGEO AMERICA
R572 R576 = RESISTOR_Dup6: as R176 on sheet 37; Tolerance: 5%; Wattage: 1/20W; Package: 0201; Distributor_name: DIGIKEY; Distributor_part_number: 311-10KNCT-ND; Height: 0.26MM; Weight: 0.17mg; Temperature: -55°C+125°C; Datasheet: Y:\MIS_DATABASE\DATASHEETS\RESISTORS\RCXXXXL-SER_MAR18.PDF; Crtd /date: MANIRAJA/050517; Chkd/date: MANIRAJA/050517; MECHANICAL 3D STEP FILE: RES0201_0-5; Library Ref: RESISTOR; Footprint Ref: RES0201_0-5; Library Path: Y:\MIS_DATABASE\Library\ALTIUM_TOOL\SCHEMATICS_PARTS\MS_DISCRETE_Library.schlib; Footprint Path: Y:\MIS_DATABASE\Library\ALTIUM_TOOL\PCB_FOOTPRINTS\Altium_Footprint_Lib.PcbLib; PCB Footprint: RES0201_0-5
SW3 = 7914G-1-000E _7914G: SWITCH SPST-NO 4MM SQ SMD 7914G; Mistral Part No: 130015110004-R; Mfr_name: BOURNS; Part_type: ELECTRO-MECHANICAL\SWITCH; Project: AAAUC; Tolerance: NA; Customs_HS_Code: 85369090; Custom_Duty: 24%; PCB Footprint: SW4_100X216_200X200_SMD_4-2; Mfr_part_number: 7914G-1-000E; Voltage: NA; Wattage: NA; Package: 7914G; Distributor_name: DIGIKEY; Distributor_part_number: 7914G-000ECT-ND; Library Ref: 7914G-1-000E _7914G; Height: 4.19MM; Weight: NA; Temperature: -55°C+125°C; Datasheet: Y:\MIS_DATABASE\DATASHEETS\ICS\DIGITAL\COMBINATIONAL\7914G-1-000E.PDF; Crtd /date: BAVISH/051010; Chkd/date: VASANTHA/271216; MECHANICAL 3D STEP FILE: SW4_100X216_200X200_SMD_4-2
SW4 = 7914G-1-000E _7914G: SWITCH SPST-NO 4MM SQ SMD 7914G; Part_type: ELECTRO-MECHANICAL\SWITCH; Mfr_name: BOURNS; Mistral Part No: 130015110004-R; Custom_Duty: 24%; Customs_HS_Code: 85369090; Wattage: NA; Project: AAAUC; PCB Footprint: SW4_100X216_200X200_SMD_4-2; MECHANICAL 3D STEP FILE: SW4_100X216_200X200_SMD_4-2; Chkd/date: VASANTHA/271216; Crtd /date: BAVISH/051010; Datasheet: Y:\MIS_DATABASE\DATASHEETS\ICS\DIGITAL\COMBINATIONAL\7914G-1-000E.PDF; Temperature: -55°C+125°C; Weight: NA; Height: 4.19MM; Library Ref: 7914G-1-000E _7914G; Distributor_part_number: 7914G-000ECT-ND; Distributor_name: DIGIKEY; Package: 7914G; Voltage: NA; Tolerance: NA; Mfr_part_number: 7914G-1-000E
TP68 TP78 TP85 = TESTPOINT: as TP49 on sheet 40; RoHS: NA; Mfr_part_number: TP20_SMD; Part_type: TESTPOINT; Package: SMD; Distributor_name: NA; Distributor_part_number: NA; Height: NA; Crtd /date: MAZHAR/171006; Chkd/date: SHREESHAIL/171006; Tolerance: NA; Voltage: NA; Wattage: NA; Weight: NA; Temperature: NA; Datasheet: NA; MECHANICAL 3D STEP FILE: NA; Library Path: Y:\MIS_DATABASE\Library\ALTIUM_TOOL\SCHEMATICS_PARTS\MS_DISCRETE_Library.schlib; Footprint Path: Y:\MIS_DATABASE\Library\ALTIUM_TOOL\PCB_FOOTPRINTS\Altium_Footprint_Lib.PcbLib; Library Ref: TESTPOINT; Footprint Ref: TP20_SMD; Customs_HS_Code: NA; Custom_Duty: NA; PCB Footprint: TP20_SMD
U82 = SN74LVC3G17DCUR_VSSOP8: IC TRIPLE SCHMITT-TRIGGER BUFFER VSSOP8; Part_type: ICS\DIGITAL\COMBINATIONAL; Mfr_name: TEXAS INSTRUMENTS; Mistral Part No: 141017090019-R; Custom_Duty: 15%; Customs_HS_Code: 85423100; Wattage: NA; Project: TI_MAXIE_CPB; MECHANICAL 3D STEP FILE: VSSOP8_19-68_85X95_0-9; Chkd/date: MANIRAJA/280917; Crtd /date: MANIRAJA/280917; Datasheet: Y:\MIS_DATABASE\DATASHEETS\ICS\DIGITAL\COMBINATIONAL\SN74LVC3G17.PDF; Temperature: -40°C+125°C; Weight: 9.6mg; Height: 0.90MM; Distributor_part_number: 296-18818-1-ND; Distributor_name: DIGIKEY; Package: VSSOP8; Voltage: NA; Tolerance: NA; Mfr_part_number: SN74LVC3G17DCUR; Library Ref: SN74LVC3G17DCUR_VSSOP8; PCB Footprint: VSSOP8_19-68_85X95_0-9

## Sheet 44.SchDoc
size 513 x 386 mm
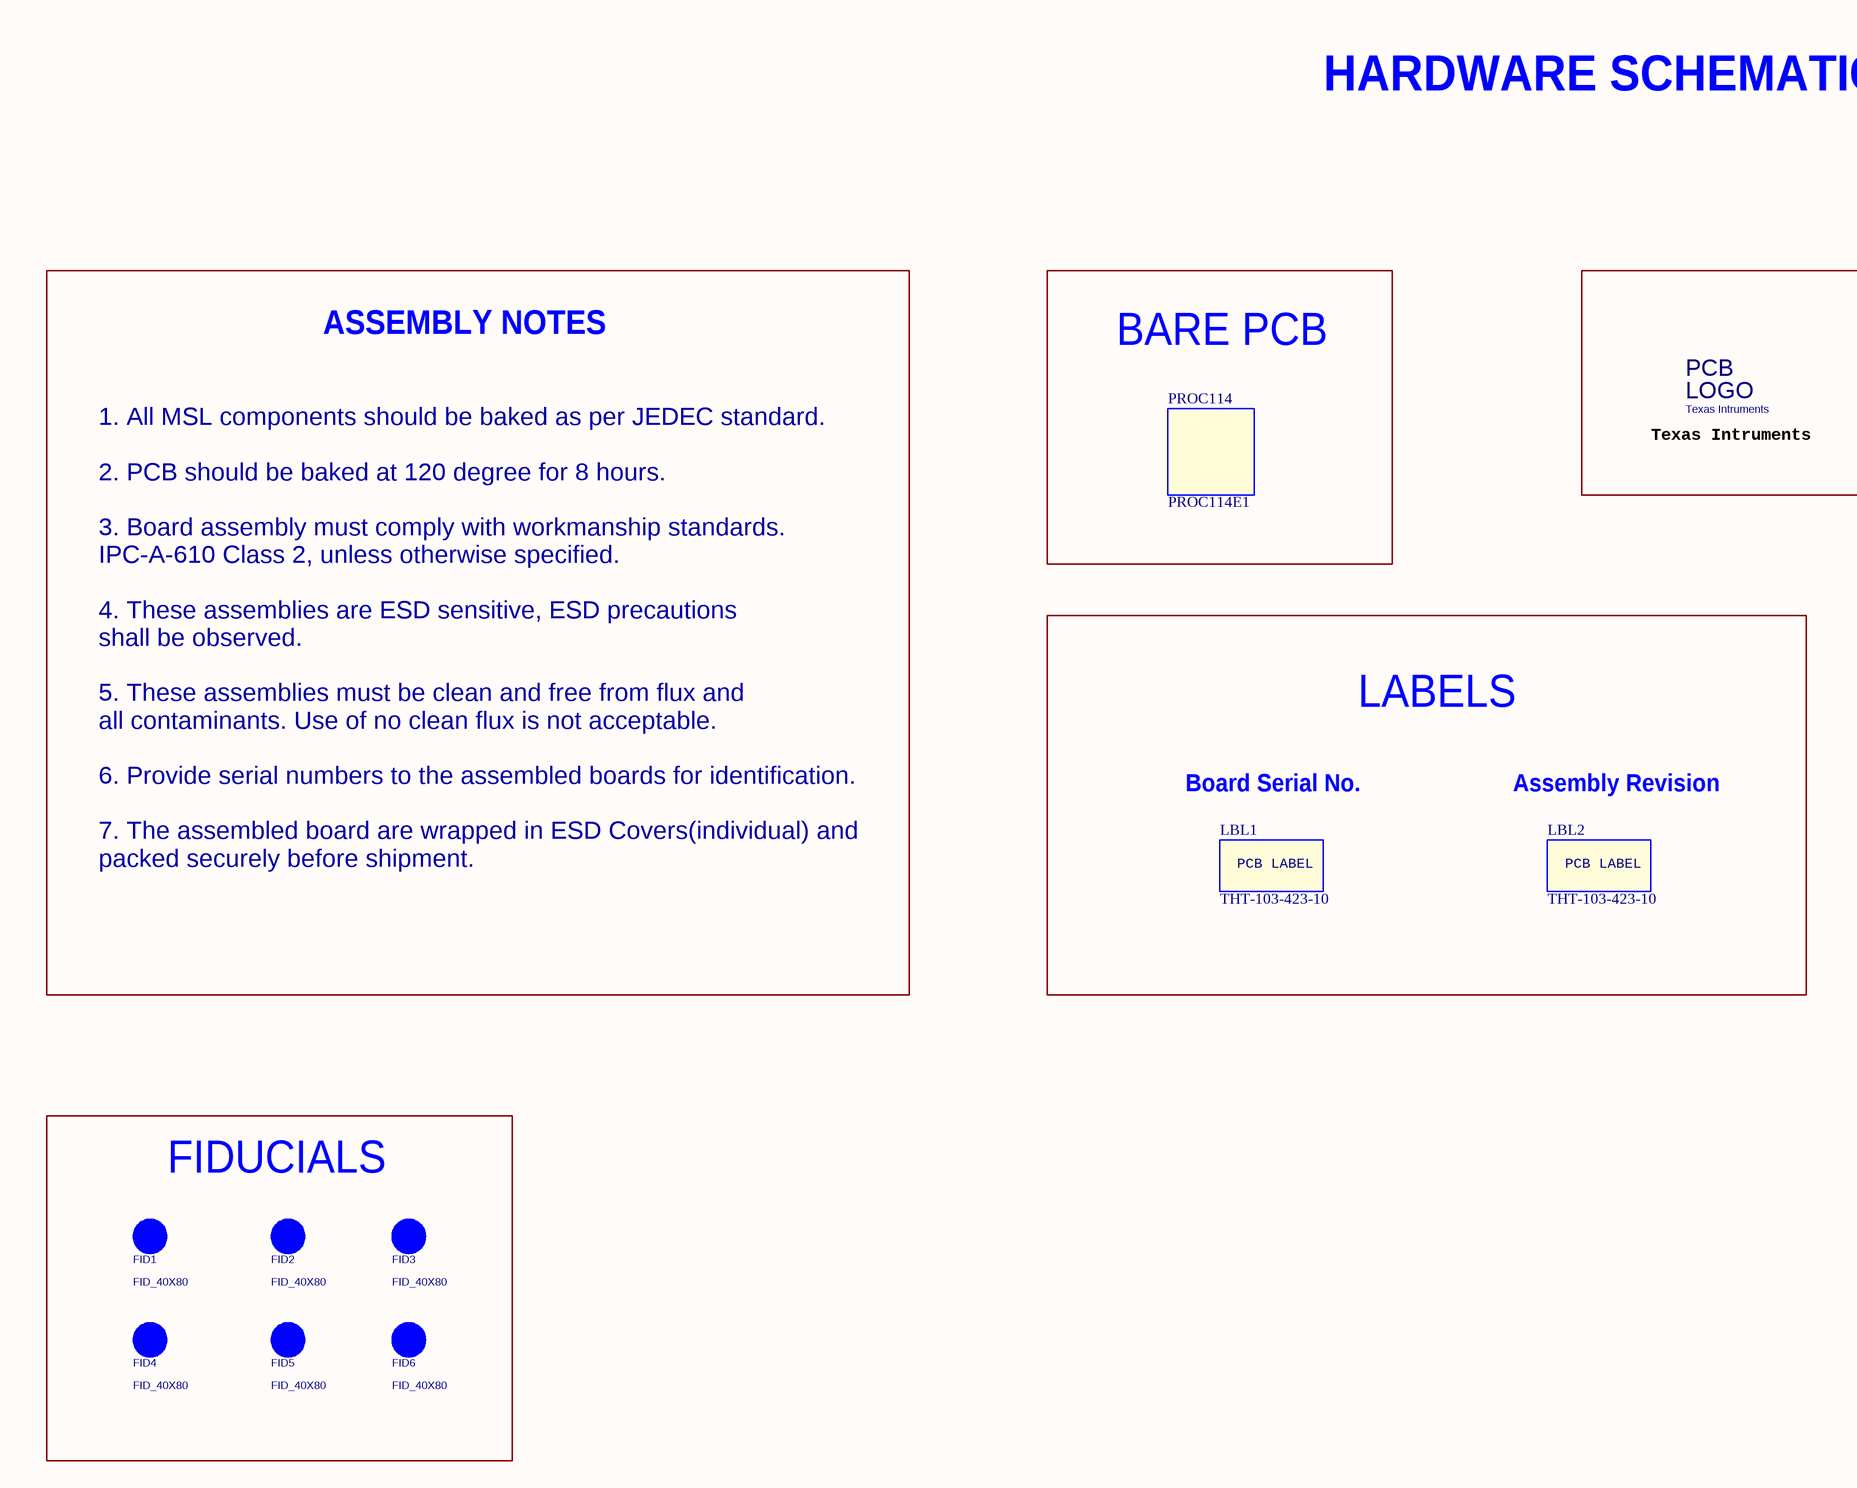
[diagram p79: 44.SchDoc, top left]
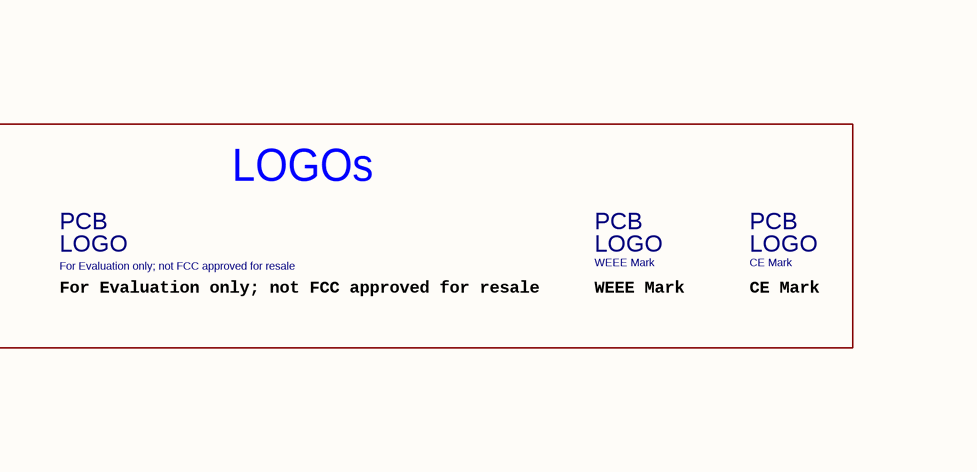
[diagram p80: 44.SchDoc, top right]
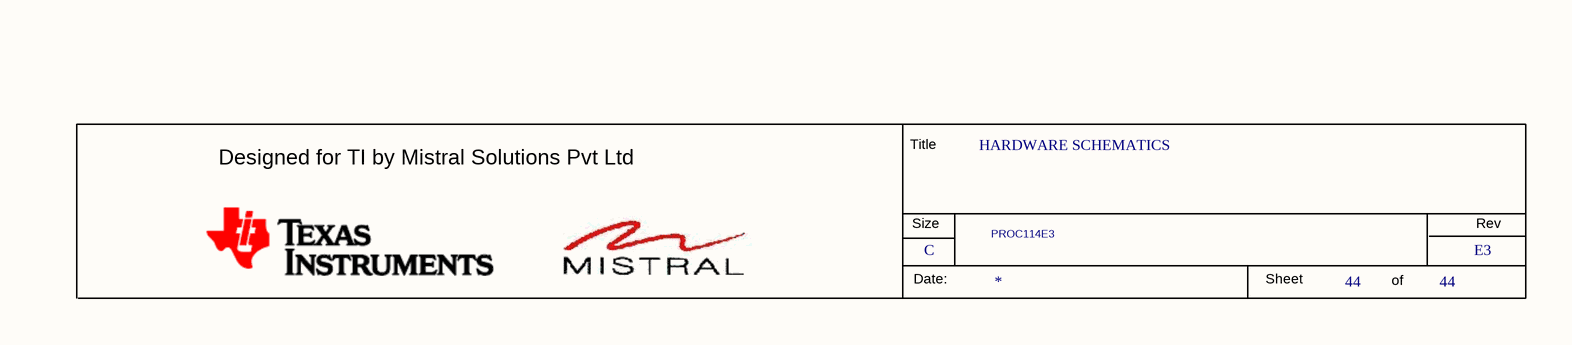
[diagram p81: 44.SchDoc, bottom right]

### Parts
(Parts that share a designator on the sheet are numbered #1, #2 ... from top to bottom, then left to right.)
*#44  RevCode: E3  Title: HARDWARE SCHEMATICS  Page Size: C  Page Number: 44  Variant Name: PROC114E3  (hidden comment: MISTRAL_TITLEBLK_CSIZE)  (graphical)
FID1  FID_40X80  [Fiducial10-20]
FID2  FID_40X80  [Fiducial10-20]
FID3  FID_40X80  [Fiducial10-20]
FID4  FID_40X80  [Fiducial10-20]
FID5  FID_40X80  [Fiducial10-20]
FID6  FID_40X80  [Fiducial10-20]
LBL1  THT-103-423-10  [NA]
LBL2  THT-103-423-10  [NA]
LOGO1  Texas Intruments  [TI_Stacked_Overlay_Small]
LOGO2  For Evaluation only; not FCC approved for resale  [FCC_disclaimer]
LOGO3  WEEE Mark  [TI_Stacked_Overlay_Small]
LOGO4  CE Mark  [TI_Stacked_Overlay_Small]
PCB1  PROC114  Mfr_part_number: PROC114E1

### Blocks framed on the sheet
BARE PCB: PCB1
LOGOs: LOGO1-LOGO4
LABELS: LBL1 LBL2
FIDUCIALS: FID1-FID6

### Notes on the sheet
- HARDWARE SCHEMATICS
- 1. All MSL components should be baked as per JEDEC standard.
  2. PCB should be baked at 120 degree for 8 hours.
  3. Board assembly must comply with workmanship standards.
  IPC-A-610 Class 2, unless otherwise specified.
  4. These assemblies are ESD sensitive, ESD precautions
  shall be observed.
  5. These assemblies must be clean and free from flux and
  all contaminants. Use of no clean flux is not acceptable.
  6. Provide serial numbers to the assembled boards for identification.
  7. The assembled board are wrapped in ESD Covers(individual) and
  packed securely before shipment.
- ASSEMBLY NOTES
- Texas Intruments
- For Evaluation only; not FCC approved for resale
- WEEE Mark
- CE Mark
- (near LBL1) Board Serial No.
- (near LBL2) Assembly Revision
- (in symbol ACCESSORY_THT-3-423-10) PCB LABEL
- (in symbol FCC_disclaimer) PCB; LOGO
- (in symbol MISTRAL_TITLEBLK_CSIZE) Title; Designed for TI by Mistral Solutions Pvt Ltd; Size; Rev; Date:; Sheet; of
- (in symbol TI_Logo) PCB; LOGO
- (in symbol TI_Logo_Dup1) PCB; LOGO

### Library data of the parts
*#44 = MISTRAL_TITLEBLK_CSIZE: Issue: 1.0; Page Create Date: March  8, 1995; Page Count: 44; Page Modify Date: *; Schematic Page Count: 44; Schematic Page Number: 44
FID1-FID6 = Fiducial: PCB Footprint: FID_40X80
LBL1 LBL2 = ACCESSORY_THT-3-423-10: ACCESSORIE 1 WORKHORSE POLYSTER LABLE 0.25" X 1"; Part_type: ACCESSORIES; Mfr_name: BRADY; Mistral Part No: 160018020185; Project: TI_MAXIE_CPB; PCB Footprint: NA; Footprint Path: Y:\MIS_DATABASE\Library\ALTIUM_TOOL\PCB_FOOTPRINTS\Altium_Footprint_Lib.PcbLib; Library Path: Y:\MIS_DATABASE\Library\ALTIUM_TOOL\SCHEMATICS_PARTS\MS_MECHANICAL_Library.schlib; MECHANICAL 3D STEP FILE: NA; Chkd/date: MANIRAJA/270218; Crtd /date: ALVY/260218; Datasheet: NA; Temperature: NA; Weight: NA; Height: NA; Footprint Ref: NA; Library Ref: ACCESSORY_THT-3-423-10; Distributor_part_number: NA; Distributor_name: NA; Package: NA; Wattage: NA; Voltage: NA; Tolerance: NA; Mfr_part_number: THT-103-423-10
LOGO1 LOGO3 = TI_Logo_Dup1
LOGO2 = FCC_disclaimer: PCB Footprint: FCC_disclaimer
LOGO4 = TI_Logo: PCB Footprint: TI_Stacked_Overlay_Small
PCB1 = PCB: AM64x EVM Bare PCB; Part_type: ACCESSORIES; Mistral Part No: FY201506000101